# EAGLE design AeroQuad_v16 (EAGLE 5.06)
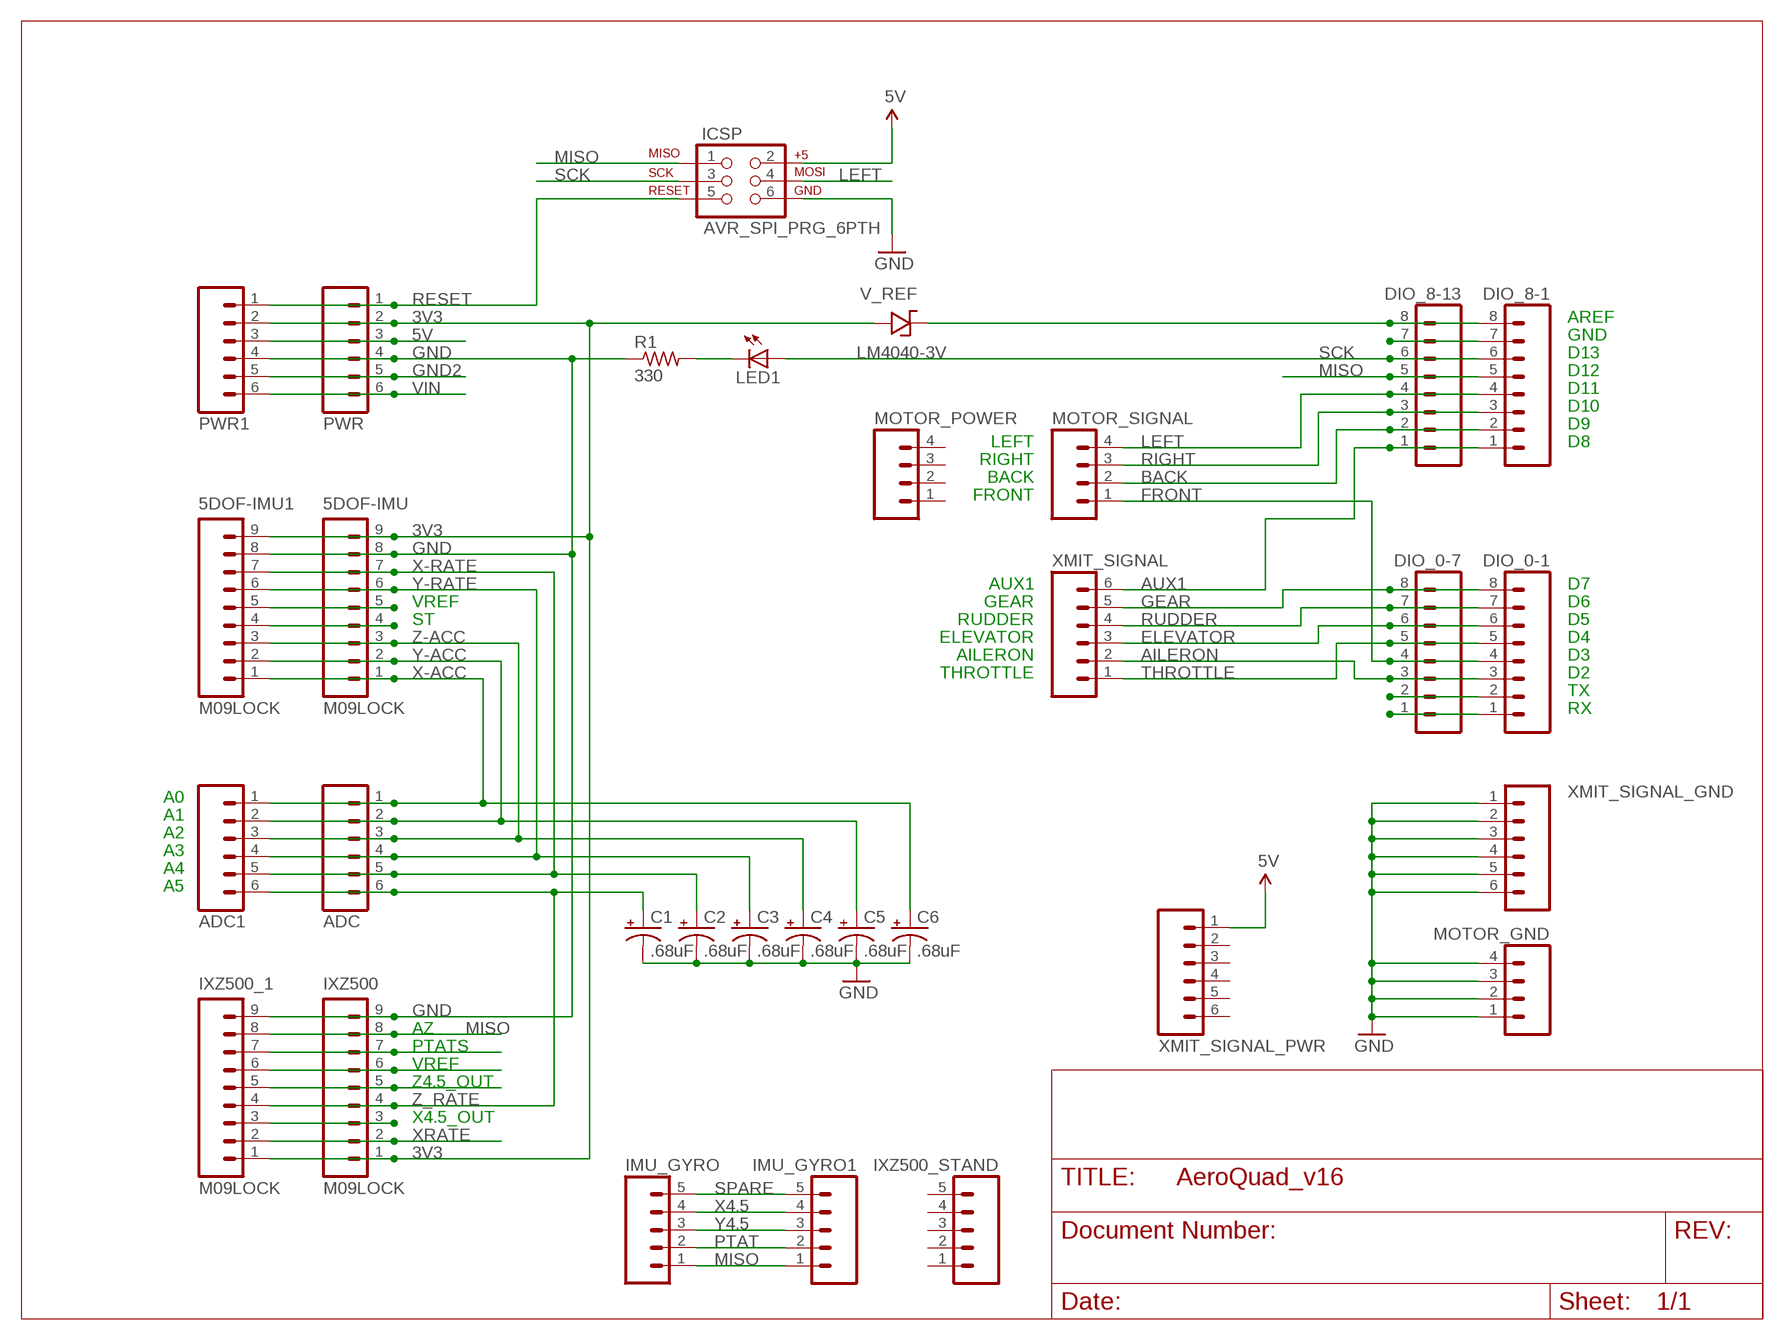
[diagram p0: schematic, sheet 1]

## Parts
5DOF-IMU  M09LOCK  [1X09_LOCK]
5DOF-IMU1  M09LOCK  [1X09_LOCK]
ADC  M06LOCK  [1X06_LOCK]
ADC1  M06LOCK  [1X06_LOCK]
C1  .68uF  CAP_POLPTH2  [CPOL-RADIAL-10UF-25V]
C2  .68uF  CAP_POLPTH2  [CPOL-RADIAL-10UF-25V]
C3  .68uF  CAP_POLPTH2  [CPOL-RADIAL-10UF-25V]
C4  .68uF  CAP_POLPTH2  [CPOL-RADIAL-10UF-25V]
C5  .68uF  CAP_POLPTH2  [CPOL-RADIAL-10UF-25V]
C6  .68uF  CAP_POLPTH2  [CPOL-RADIAL-10UF-25V]
DIO_0-1  M08LOCK  [1X08_LOCK]
DIO_0-7  M08LOCK  [1X08_LOCK]
DIO_8-1  M08LOCK  [1X08_LOCK]
DIO_8-13  M08LOCK  [1X08_LOCK]
ICSP  AVR_SPI_PRG_6PTH  [2X3]
IMU_GYRO  M05LOCK  [1X05_LOCK]
IMU_GYRO1  M05LOCK  [1X05_LOCK]
IXZ500  M09LOCK  [1X09_LOCK]
IXZ500_1  M09LOCK  [1X09_LOCK]
IXZ500_STAND  M05LOCK  [1X05_LOCK]
LED1  LED5MM  [LED5MM]
MOTOR_GND  M04LOCK  [1X04_LOCK]
MOTOR_POWER  M04LOCK  [1X04_LOCK]
MOTOR_SIGNAL  M04LOCK  [1X04_LOCK]
PWR  M06LOCK  [1X06_LOCK]
PWR1  M06LOCK  [1X06_LOCK]
R1  330  R-US_0204/5  [0204/5]
V_REF  LM4040-3V  [TO-92]
XMIT_SIGNAL  M06LOCK  [1X06_LOCK]
XMIT_SIGNAL_GND  M06LOCK  [1X06_LOCK]
XMIT_SIGNAL_PWR  M06LOCK  [1X06_LOCK]

## Nets
3V3: 5DOF-IMU1.9 5DOF-IMU.9 IXZ500.1 IXZ500_1.1 PWR1.2 PWR.2 V_REF.1(ANODE)
5V: ICSP.2 PWR1.3 PWR.3 XMIT_SIGNAL_PWR.1
AILERON: DIO_0-1.3 DIO_0-7.3 XMIT_SIGNAL.2
AREF: DIO_8-1.8 DIO_8-13.8 V_REF.2(CATHODE)
AUX1: DIO_8-1.1 DIO_8-13.1 XMIT_SIGNAL.6
BACK: DIO_8-1.2 DIO_8-13.2 MOTOR_SIGNAL.2
ELEVATOR: DIO_0-1.6 DIO_0-7.6 XMIT_SIGNAL.3
FRONT: DIO_0-1.4 DIO_0-7.4 MOTOR_SIGNAL.1
GEAR: DIO_0-1.8 DIO_0-7.8 XMIT_SIGNAL.5
GND: 5DOF-IMU1.8 5DOF-IMU.8 C1.2(-) C2.2(-) C3.2(-) C4.2(-) C5.2(-) C6.2(-) ICSP.6 IXZ500.9 IXZ500_1.9 MOTOR_GND.1 MOTOR_GND.2 MOTOR_GND.3 MOTOR_GND.4 PWR1.4 PWR.4 R1.1 XMIT_SIGNAL_GND.1 XMIT_SIGNAL_GND.2 XMIT_SIGNAL_GND.3 XMIT_SIGNAL_GND.4 XMIT_SIGNAL_GND.5 XMIT_SIGNAL_GND.6
GND2: PWR1.5 PWR.5
LEFT: DIO_8-1.4 DIO_8-13.4 ICSP.4 MOTOR_SIGNAL.4
MISO: DIO_8-1.5 DIO_8-13.5 ICSP.1 IMU_GYRO1.1 IMU_GYRO.1 IXZ500.8 IXZ500_1.8
N$1: DIO_8-1.7 DIO_8-13.7
N$2: LED1.K(C) R1.2
N$9: 5DOF-IMU1.5 5DOF-IMU.5
N$11: 5DOF-IMU1.4 5DOF-IMU.4
N$13: IXZ500.7 IXZ500_1.7
N$15: IXZ500.6 IXZ500_1.6
N$16: IXZ500.5 IXZ500_1.5
N$18: IXZ500.3 IXZ500_1.3
N$25: DIO_0-1.2 DIO_0-7.2
N$26: DIO_0-1.1 DIO_0-7.1
PTAT: IMU_GYRO1.2 IMU_GYRO.2
RESET: ICSP.5 PWR1.1 PWR.1
RIGHT: DIO_8-1.3 DIO_8-13.3 MOTOR_SIGNAL.3
RUDDER: DIO_0-1.7 DIO_0-7.7 XMIT_SIGNAL.4
SCK: DIO_8-1.6 DIO_8-13.6 ICSP.3 LED1.A
SPARE: IMU_GYRO1.5 IMU_GYRO.5
THROTTLE: DIO_0-1.5 DIO_0-7.5 XMIT_SIGNAL.1
VIN: PWR1.6 PWR.6
X4.5: IMU_GYRO1.4 IMU_GYRO.4
X-ACC: 5DOF-IMU1.1 5DOF-IMU.1 ADC1.1 ADC.1 C6.1(+)
X-RATE: 5DOF-IMU1.7 5DOF-IMU.7 ADC1.5 ADC.5 C2.1(+)
XRATE: IXZ500.2 IXZ500_1.2
Y4.5: IMU_GYRO1.3 IMU_GYRO.3
Y-ACC: 5DOF-IMU1.2 5DOF-IMU.2 ADC1.2 ADC.2 C5.1(+)
Y-RATE: 5DOF-IMU1.6 5DOF-IMU.6 ADC1.4 ADC.4 C3.1(+)
Z-ACC: 5DOF-IMU1.3 5DOF-IMU.3 ADC1.3 ADC.3 C4.1(+)
Z_RATE: ADC1.6 ADC.6 C1.1(+) IXZ500.4 IXZ500_1.4
Unconnected: IXZ500_STAND.1 IXZ500_STAND.2 IXZ500_STAND.3 IXZ500_STAND.4 IXZ500_STAND.5 MOTOR_POWER.1 MOTOR_POWER.2 MOTOR_POWER.3 MOTOR_POWER.4 V_REF.3(NC) XMIT_SIGNAL_PWR.2 XMIT_SIGNAL_PWR.3 XMIT_SIGNAL_PWR.4 XMIT_SIGNAL_PWR.5 XMIT_SIGNAL_PWR.6

## Notes on the sheet
- AREF
- GND
- D13
- D12
- D11
- D10
- D9
- LEFT | D8
- RIGHT
- BACK
- FRONT
- AUX1 | D7
- VREF | GEAR | D6
- ST | RUDDER | D5
- ELEVATOR | D4
- AILERON | D3
- THROTTLE | D2
- TX
- RX
- A0
- A1
- A2
- A3
- A4
- A5
- AZ
- PTATS
- VREF
- Z4.5_OUT
- X4.5_OUT

## Library data of the parts
5DOF-IMU 5DOF-IMU1 IXZ500 IXZ500_1 = SparkFun:M09: Header 9 Standard 9-pin 0.1" header. Use with straight break away headers (SKU : PRT-00116), right angle break away headers (PRT-00553), swiss pins (PRT-00743), machine pins (PRT-00117), and female headers (PRT-00115).
ADC ADC1 PWR PWR1 XMIT_SIGNAL XMIT_SIGNAL_GND XMIT_SIGNAL_PWR = SparkFun:M06: Header 6 Standard 6-pin 0.1" header. Use with straight break away headers (SKU : PRT-00116), right angle break away headers (PRT-00553), swiss pins (PRT-00743), machine pins (PRT-00117), and female headers (PRT-00115). Molex polarized connector foot print use with SKU : PRT-08094 with associated crimp pins and housings. NOTES ON THE VARIANTS LOCK and LOCK_LONGPADS... This footprint was designed to help hold the alignment of a through-hole component (i.e. 6-pin header) while soldering it into place. You may notice that each hole has been shifted either up or down by 0.005 of an inch from it's more standard position (which is a perfectly straight line). This slight alteration caused the pins (the squares in the middle) to touch the edges of the holes. Because they are alternating, it causes a "brace" to hold the component in place. 0.005 has proven to be the perfect amount of "off-center" position when using our standard breakaway headers. Although looks a little odd when you look at the bare footprint, once you have a header in there, the alteration is very hard to notice. Also, if you push a header all the way into place, it is covered up entirely on the bottom side. This idea of altering the position of holes to aid alignment will be further integrated into the Sparkfun Library for other footprints. It can help hold any component with 3 or more connection pins.
C1-C6 = SparkFun:CAP_POL: Capacitor Polarized These are standard SMD and PTH capacitors. Normally 10uF, 47uF, and 100uF in electrolytic and tantalum varieties. Always verify the external diameter of the through hole cap, it varies with capacity, voltage, and manufacturer. The EIA devices should be standard.
DIO_0-1 DIO_0-7 DIO_8-1 DIO_8-13 = SparkFun:M08: Header 8 Standard 8-pin 0.1" header. Use with straight break away headers (SKU : PRT-00116), right angle break away headers (PRT-00553), swiss pins (PRT-00743), machine pins (PRT-00117), and female headers (PRT-00115).
ICSP = SparkFun:AVR_SPI_PRG_6: AVR ISP 6 Pin This is the reduced ISP connector for AVR programming. Common on Arduino. This footprint will take up less PCB space and can be used with a 10-pin to 6-pin adapter such as SKU: BOB-08508
IMU_GYRO IMU_GYRO1 IXZ500_STAND = SparkFun:M05: Header 5 Standard 5-pin 0.1" header. Use with straight break away headers (SKU : PRT-00116), right angle break away headers (PRT-00553), swiss pins (PRT-00743), machine pins (PRT-00117), and female headers (PRT-00115). Molex polarized connector foot print use with SKU : PRT-08230 with associated crimp pins and housings.
LED1 = SparkFun:LED: LEDs Standard schematic elements and footprints for 5mm, 3mm, 1206, and 0603 sized LEDs. 5mm - Spark Fun Electronics SKU : COM-00529 (and others)
MOTOR_GND MOTOR_POWER MOTOR_SIGNAL = SparkFun:M04: Header 4 Standard 4-pin 0.1" header. Use with straight break away headers (SKU : PRT-00116), right angle break away headers (PRT-00553), swiss pins (PRT-00743), machine pins (PRT-00117), and female headers (PRT-00115). Molex polarized connector foot print use with SKU : PRT-08231 with associated crimp pins and housings.
R1 = resistor:R-US_: RESISTOR, American symbol
V_REF = CaranchoEngineering:LM4040: The LM4040 series of shunt voltage references are versatile, easy-to-use references that cater to a vast array of applications. The 2-pin fixed-output device requires no external capacitors for operation and is stable with all capacitive loads. Additionally, the reference offers low dynamic impedance, low noise, and low temperature coefficient to ensure a stable output voltage over a wide range of operating currents and temperatures.

## Board
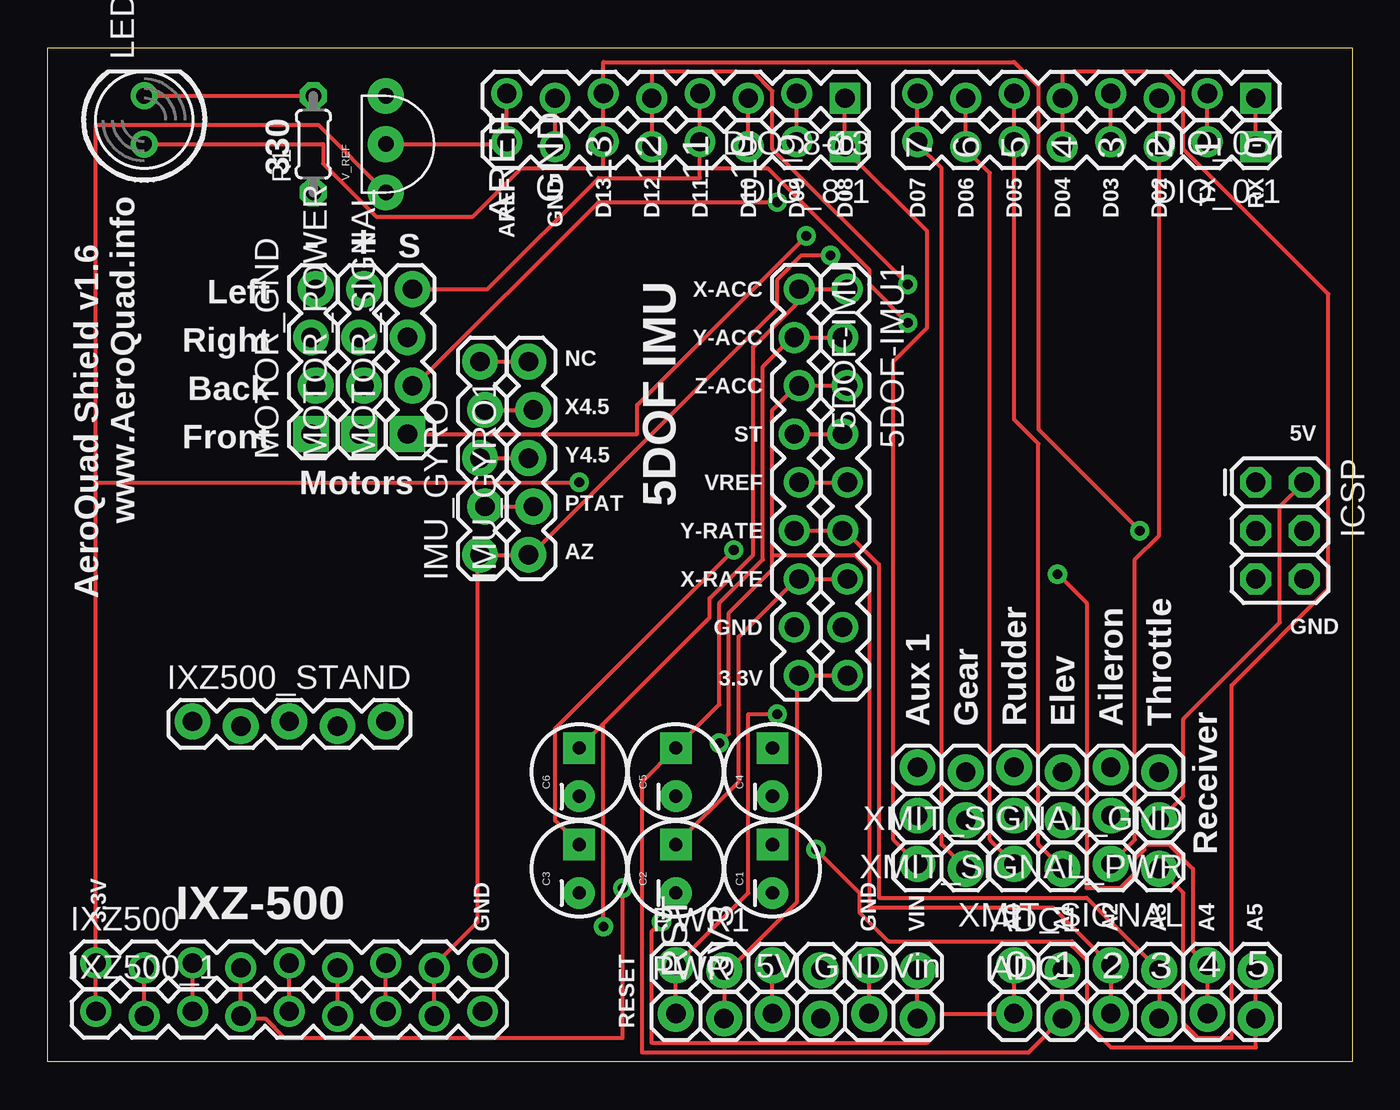
[diagram p1: board, top side]
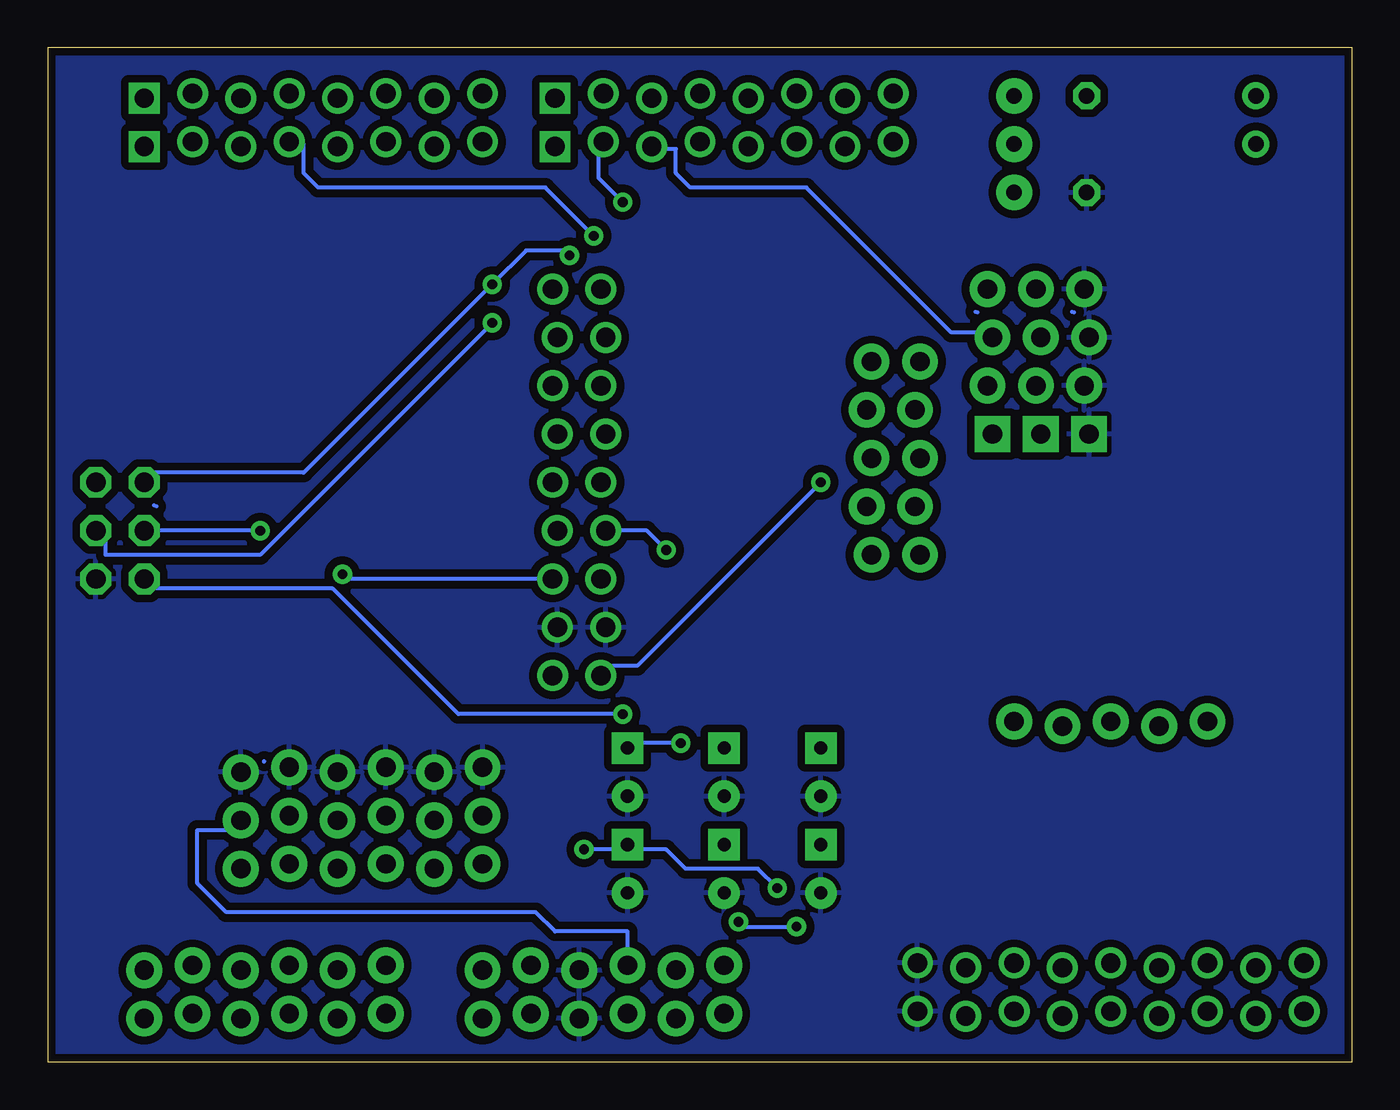
[diagram p2: board, bottom side, seen from below]

Size 68.58 x 53.34 mm. Coordinates in mm from the lower left corner, seen from the top.
Outline: 0,53.34 68.58,53.34 68.58,0 0,0 0,53.34
Copper layers (1*16): Top 0.035mm / dielectric 1.5mm / Bottom 0.035mm
Design rules "SparkFun": minimum track width 8mil, minimum drill 20mil, track to track 8mil, track to pad 8mil, pad to pad 8mil, via to via 8mil, smd to smd 8mil, copper to edge 10mil, drill to drill 8mil, minimum pad ring 12mil, minimum via ring 10mil, stop-mask expansion 4mil, vias tented up to drill 25mil, thermal gap 10mil

### Footprints (pad centres in the part's own frame; a part is rotated, then mirrored left to right if it is on the bottom)
1X09_LOCK = drill 1.016 round: 1 0,0.127; 2 2.54,-0.127; 3 5.08,0.127; 4 7.62,-0.127; 5 10.16,0.127; 6 12.7,-0.127; 7 15.24,0.127; 8 17.78,-0.127; 9 20.32,0.127
1X06_LOCK = drill 1.016 pad 1.88 round: 1 0,0; 2 2.54,-0.254; 3 5.08,0; 4 7.62,-0.254; 5 10.16,0; 6 12.7,-0.254
CPOL-RADIAL-10UF-25V = drill 0.7 pad 1.651 square: 1 1.27,0 | drill 0.7 pad 1.651 round: 2 -1.27,0
1X08_LOCK = drill 1.016 square: 1 0,0.127 | drill 1.016 round: 2 2.54,-0.127; 3 5.08,0.127; 4 7.62,-0.127; 5 10.16,0.127; 6 12.7,-0.127; 7 15.24,0.127; 8 17.78,-0.127
2X3 = drill 1.016 octagon: 1 0,0; 2 0,2.54; 3 2.54,0; 4 2.54,2.54; 5 5.08,0; 6 5.08,2.54
1X05_LOCK = drill 1.016 pad 1.88 round: 1 0,0.127; 2 2.54,-0.127; 3 5.08,0.127; 4 7.62,-0.127; 5 10.16,0.127
LED5MM = drill 0.813 round: A -1.27,0; K 1.27,0
1X04_LOCK = drill 1.016 pad 1.88 square: 1 0,0.127 | drill 1.016 pad 1.88 round: 2 2.54,-0.127; 3 5.08,0.127; 4 7.62,-0.127
0204/5 = drill 0.813 octagon: 1 -2.54,0; 2 2.54,0
TO-92 = drill 0.813 pad 1.88 round: 1 -2.54,0; 2 0,0; 3 2.54,0

### Placement (x,y rotation side)
5DOF-IMU  39.37,40.64 270 top
5DOF-IMU1  41.91,40.64 270 top
ADC  50.8,2.54 0 top
ADC1  50.8,5.08 0 top
C1  38.1,10.16 90 top
C2  33.02,10.16 90 top
C3  27.94,10.16 90 top
C4  38.1,15.24 90 top
C5  33.02,15.24 90 top
C6  27.94,15.24 90 top
DIO_0-1  63.5,48.26 180 top
DIO_0-7  63.5,50.8 180 top
DIO_8-1  41.91,48.26 180 top
DIO_8-13  41.91,50.8 180 top
ICSP  63.5,30.48 270 top
IMU_GYRO  22.86,26.67 90 top
IMU_GYRO1  25.4,26.67 90 top
IXZ500  2.54,5.08 0 top
IXZ500_1  2.54,2.54 0 top
IXZ500_STAND  7.62,17.78 0 top
LED1  5.08,49.53 90 top
MOTOR_GND  13.97,33.02 90 top
MOTOR_POWER  16.51,33.02 90 top
MOTOR_SIGNAL  19.05,33.02 90 top
PWR  33.02,2.54 0 top
PWR1  33.02,5.08 0 top
R1  13.97,48.26 90 top
V_REF  17.78,48.26 90 top
XMIT_SIGNAL  58.42,10.16 180 top
XMIT_SIGNAL_GND  58.42,15.24 180 top
XMIT_SIGNAL_PWR  58.42,12.7 180 top

### Tracks (layer width: path | path; a pad name or v marks a point on that pad's centre or on a via)
3V3  (via drill 0.51)
  Top 0.203: 5DOF-IMU1.9 5DOF-IMU.9 39.37,20.32 39.37,8.38 35.56,4.57 | 35.56,4.57 PWR.2 | 35.56,4.57 PWR1.2 | IXZ500_1.1 IXZ500.1 2.54,30.48 | V_REF.1 14.22,49.28 2.54,49.28 2.54,30.48 | 2.54,30.48 v27.94,30.48
  Bottom 0.203: v27.94,30.48 37.59,20.83 38.86,20.83 39.37,20.32 5DOF-IMU.9
5V
  Top 0.203: PWR.3 PWR1.3 | ICSP.2 64.77,29.21 64.77,23.11 59.69,18.03 59.69,13.97 XMIT_SIGNAL_PWR.1
  Bottom 0.203: PWR1.3 38.1,6.86 41.91,6.86 42.93,7.87 59.18,7.87 60.71,9.4 60.71,12.19 58.93,12.19 XMIT_SIGNAL_PWR.1
AILERON
  Top 0.203: DIO_0-7.3 DIO_0-1.3 58.42,27.69 57.15,26.42 57.15,11.68 XMIT_SIGNAL.2
AREF
  Top 0.203: DIO_8-13.8 DIO_8-1.8 24.13,48.26 V_REF.2
AUX1
  Top 0.203: DIO_8-13.1 DIO_8-1.1 41.91,48.01 46.23,43.69 46.23,38.61 44.45,36.83 44.45,11.68 XMIT_SIGNAL.6
BACK  (via drill 0.51)
  Top 0.203: DIO_8-1.2 DIO_8-13.2 | v38.35,45.21 28.96,45.21 19.3,35.56 MOTOR_SIGNAL.2
  Bottom 0.203: v38.35,45.21 39.62,46.48 39.62,48.26 39.37,48.26 DIO_8-1.2
ELEVATOR
  Top 0.203: DIO_0-7.6 DIO_0-1.6 50.8,33.78 52.07,32.51 52.07,11.43 XMIT_SIGNAL.3
FRONT  (via drill 0.51)
  Top 0.203: DIO_0-1.4 DIO_0-7.4 | v39.88,43.43 30.99,34.54 30.99,33.02 MOTOR_SIGNAL.1
  Bottom 0.203: v39.88,43.43 42.42,45.97 54.36,45.97 55.12,46.74 55.12,48.26 55.88,48.26 DIO_0-1.4
GEAR
  Top 0.203: DIO_0-7.8 DIO_0-1.8 45.72,48.26 46.99,46.99 46.99,11.43 XMIT_SIGNAL.5
GND
  pour Bottom (isolate 0.406): 0,53.34 68.58,53.34 68.58,0 0,0
GND2
  Top 0.203: PWR.5 PWR1.5
LEFT  (via drill 0.51)
  Top 0.203: DIO_8-13.4 DIO_8-1.4 34.29,46.99 | v45.21,38.86 43.18,40.89 43.18,41.66 37.85,46.99 34.29,46.99 | 34.29,46.99 34.29,46.48 28.96,46.48 23.11,40.64 MOTOR_SIGNAL.4
  Bottom 0.203: ICSP.4 65.53,27.43 65.53,26.67 57.4,26.67 v45.21,38.86
MISO  (via drill 0.51)
  Top 0.203: IXZ500_1.8 IXZ500.8 20.32,5.08 22.61,7.37 22.61,26.67 IMU_GYRO.1 IMU_GYRO1.1 25.4,26.67 38.35,39.62 38.35,41.15 39.62,42.42 v41.15,42.42 | v45.21,40.89 38.1,48.01 38.1,51.05 37.08,52.07 31.75,52.07 DIO_8-13.5 DIO_8-1.5
  Bottom 0.203: ICSP.1 62.99,30.99 55.12,30.99 v45.21,40.89 43.43,42.67 41.4,42.67 v41.15,42.42
N$1
  Top 0.203: DIO_8-1.7 DIO_8-13.7
N$2
  Top 0.203: LED1.K R1.2
N$5
  Bottom 0.203: 62.87,29.21 62.99,29.26
N$7
  Bottom 0.203: 19.81,39.45 19.71,39.42
N$8
  Bottom 0.203: 57.2,15.82 57.2,15.8
N$9
  Top 0.203: 5DOF-IMU.5 5DOF-IMU1.5
N$10
  Bottom 0.203: 14.73,39.45 14.63,39.42
N$11
  Top 0.203: 5DOF-IMU.4 5DOF-IMU1.4
N$13
  Top 0.203: IXZ500_1.7 IXZ500.7
N$15
  Top 0.203: IXZ500_1.6 IXZ500.6
N$16
  Top 0.203: IXZ500_1.5 IXZ500.5
N$18
  Top 0.203: IXZ500_1.3 IXZ500.3
N$25
  Top 0.203: DIO_0-1.2 DIO_0-7.2
N$26
  Top 0.203: DIO_0-1.1 DIO_0-7.1
PTAT
  Top 0.203: IMU_GYRO.2 IMU_GYRO1.2
RESET  (via drill 0.51)
  Top 0.203: v38.35,18.29 36.83,18.29 36.83,8.89 PWR1.1 PWR.1
  Bottom 0.203: ICSP.5 62.99,24.89 53.59,24.89 46.99,18.29 v38.35,18.29
RIGHT
  Top 0.203: DIO_8-1.3 DIO_8-13.3
  Bottom 0.203: MOTOR_SIGNAL.3 19.05,38.1 19.3,38.35 21.08,38.35 28.7,45.97 34.8,45.97 35.56,46.74 35.56,48.01 36.83,48.01 DIO_8-1.3
RUDDER
  Top 0.203: DIO_0-7.7 DIO_0-1.7 48.26,48.01 49.53,46.74 49.53,11.68 XMIT_SIGNAL.4
SCK  (via drill 0.51)
  Top 0.203: LED1.A 14.48,48.26 14.48,47.24 17.27,44.45 22.35,44.45 24.89,46.99 29.21,46.99 DIO_8-1.6 DIO_8-13.6 29.21,52.58 50.8,52.58 52.07,51.31 52.07,33.27 v57.4,27.94
  Bottom 0.203: v57.4,27.94 ICSP.3
SPARE
  Top 0.203: IMU_GYRO.5 IMU_GYRO1.5
THROTTLE
  Top 0.203: DIO_0-1.5 DIO_0-7.5 53.34,52.07 58.67,52.07 59.69,51.05 59.69,48.01 67.31,40.39 67.31,24.89 62.23,19.81 62.23,1.27 60.45,1.27 59.69,2.03 59.69,8.89 XMIT_SIGNAL.1
VIN
  Top 0.203: PWR.6 PWR1.6
X4.5
  Top 0.203: IMU_GYRO.4 IMU_GYRO1.4
X-ACC  (via drill 0.51)
  Top 0.203: ADC1.1 ADC.1 46.99,2.54 46.99,1.78 46.23,1.02 31.75,1.02 31.75,6.86 v32.26,7.37 | 5DOF-IMU1.1 5DOF-IMU.1 39.37,40.64 39.37,39.88 37.08,37.59 37.08,26.67 34.8,24.38 34.8,23.37 29.21,17.78 | 29.21,17.78 C6.1 | v29.21,7.11 29.21,17.78
  Bottom 0.203: v32.26,7.37 32,7.11 v29.21,7.11
X-RATE  (via drill 0.51)
  Top 0.203: ADC.5 ADC1.5 60.2,5.84 60.2,10.16 58.93,11.43 57.66,11.43 57.66,11.18 57.15,10.67 57.15,9.91 56.39,9.14 54.61,9.14 54.61,24.13 v53.09,25.65 | 5DOF-IMU1.7 5DOF-IMU.7 39.37,25.4 36.32,22.35 36.32,14.73 C2.1
  Bottom 0.203: v53.09,25.65 52.83,25.4 5DOF-IMU1.7
XRATE
  Top 0.203: IXZ500_1.2 IXZ500.2
Y4.5
  Top 0.203: IMU_GYRO.3 IMU_GYRO1.3
Y-ACC
  Top 0.203: ADC1.2 ADC.2 51.56,0.51 31.24,0.51 31.24,14.73 C5.1 35.31,18.8 35.31,24.13 37.59,26.42 37.59,36.58 39.12,38.1 5DOF-IMU.2 5DOF-IMU1.2
Y-RATE  (via drill 0.51)
  Top 0.203: ADC.4 ADC1.4 54.61,8.64 43.69,8.64 43.69,26.16 41.91,27.94 5DOF-IMU1.6 5DOF-IMU.6 | C3.1 26.67,12.7 26.67,17.53 v36.07,26.92
  Bottom 0.203: v36.07,26.92 37.08,27.94 5DOF-IMU.6
Z-ACC  (via drill 0.51)
  Top 0.203: ADC.3 ADC1.3 52.83,8.13 43.18,8.13 43.18,25.91 42.42,26.67 38.1,26.67 | 5DOF-IMU1.3 5DOF-IMU.3 39.37,35.56 38.1,34.29 38.1,26.67 | v35.31,16.76 35.81,17.27 35.81,23.62 38.1,25.91 38.1,26.67
  Bottom 0.203: C4.1 37.85,16.76 v35.31,16.76
Z_RATE  (via drill 0.51)
  Top 0.203: IXZ500.4 IXZ500_1.4 10.16,2.29 11.43,2.29 12.45,1.27 30.23,1.27 v30.23,9.14 | v40.39,11.18 42.67,8.89 42.67,7.87 44.2,6.35 53.85,6.35 53.85,6.1 54.61,5.33 54.61,2.03 55.88,0.76 63.5,0.76 ADC.6 ADC1.6
  Bottom 0.203: 38.35,11.18 v40.39,11.18 | v30.23,9.14 31.24,10.16 35.05,10.16 36.07,11.18 38.35,11.18 | 38.35,11.18 C1.1

### Text on the board
tPlace: 330 | AREF | GND | D13 | D12 | D11 | D10 | D09 | D08 | D07 | D06 | D05 | D04 | D03 | D02 | TX | RX | - | + | S | Left | X-ACC | Right | Y-ACC | NC | Back | Z-ACC | Front | X4.5 | ST | 5V | Y4.5 | VREF | Motors | PTAT | 5DOF IMU | www.AeroQuad.info | Y-RATE | AZ | X-RATE | AeroQuad Shield v1.6 | GND | GND | 3.3V | Aux 1 | Gear | Rudder | Elev | Aileron | Throttle | Receiver | 3.3V | IXZ-500 | GND | GND | VIN | A0 | A1 | A2 | A3 | A4 | A5 | RESET
tNames: 9 | 8 | 7 | 6 | 5 | 4 | 3 | 2 | 1 | 0 | 13 | 12 | 11 | 10 | GND | AREF | RST | 3V3 | 5V | GND | Vin | 0 | 1 | 2 | 3 | 4 | 5